# EAGLE design OLX_FOH_Lights (EAGLE 8.6.0)
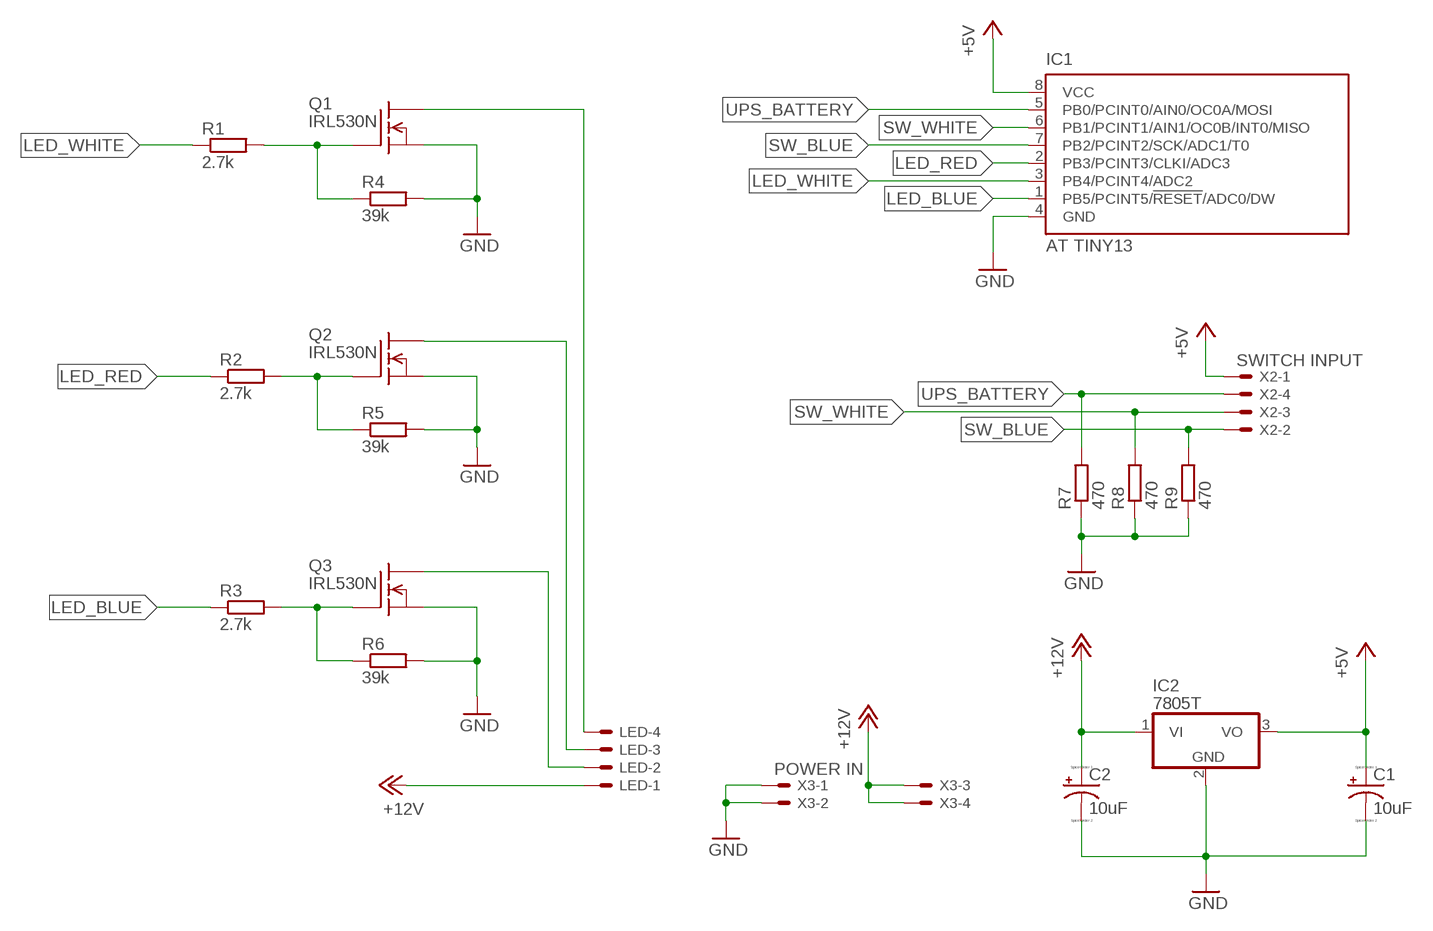
[diagram p0: schematic, sheet 1]

## Parts
C1  10uF  CPOL-USTT2D4  [TT2D4]
C2  10uF  CPOL-USTT2D4  [TT2D4]
IC1  AT TINY13  TINY13-20PU  [DIL08]
IC2  7805T  [TO220H]
LED  LED OUTPUT  22-23-2041  [22-23-2041]
Q1  IRL530N  BUZ10  [TO220]
Q2  IRL530N  BUZ10  [TO220]
Q3  IRL530N  BUZ10  [TO220]
R1  2.7k  R-EU_0411/12  [0411/12]
R2  2.7k  R-EU_0411/12  [0411/12]
R3  2.7k  R-EU_0411/12  [0411/12]
R4  39k  R-EU_0411/12  [0411/12]
R5  39k  R-EU_0411/12  [0411/12]
R6  39k  R-EU_0411/12  [0411/12]
R7  470  R-EU_0411/12  [0411/12]
R8  470  R-EU_0411/12  [0411/12]
R9  470  R-EU_0411/12  [0411/12]
X2  SWITCH INPUT  22-23-2041  [22-23-2041]
X3  POWER IN  22-23-2041  [22-23-2041]

## Nets
+5V: C1.+ IC1.8(VCC) IC2.3(VO) X2.1
+12V: C2.+ IC2.1(VI) LED.1 X3.3 X3.4
GND: C1.- C2.- IC1.4(GND) IC2.2(GND) Q1.3(S) Q2.3(S) Q3.3(S) R4.2 R5.2 R6.2 R7.1 R8.1 R9.1 X3.1 X3.2
LED_BLUE: IC1.1(PB5/PCINT5/!RESET!/ADC0/DW) R3.1
LED_RED: IC1.2(PB3/PCINT3/CLKI/ADC3) R2.1
LED_WHITE: IC1.3(PB4/PCINT4/ADC2) R1.1
N$1: Q1.1(G) R1.2 R4.1
N$2: LED.4 Q1.2(D)
N$3: LED.3 Q2.2(D)
N$4: Q3.1(G) R3.2 R6.1
N$5: LED.2 Q3.2(D)
N$7: Q2.1(G) R2.2 R5.1
SW_BLUE: IC1.7(PB2/PCINT2/SCK/ADC1/T0) R9.2 X2.2
SW_WHITE: IC1.6(PB1/PCINT1/AIN1/OC0B/INT0/MISO) R8.2 X2.3
UPS_BATTERY: IC1.5(PB0/PCINT0/AIN0/OC0A/MOSI) R7.2 X2.4

## Library data of the parts
C1 C2 = resistor:CPOL-US: POLARIZED CAPACITOR, American symbol
IC1 = atmel:TINY13: 8-bit AVR Microcontroller with 1K Bytes In-System Programmable Flash Source: http://www.atmel.com/dyn/resources/prod_documents/2535S.pdf; MPN: ATTINY13-20PU; OC_FARNELL: 9171550; OC_NEWARK: 96K6521
IC2 = linear:78*: Positive VOLTAGE REGULATOR Source: http://cache.national.com/ds/LM/LM78L05.pdf http://www.fairchildsemi.com/ds/LM/LM7805.pdf
LED X2 X3 = con-molex:22-23-2041: .100" (2.54mm) Center Header - 4 Pin; MF: MOLEX; MPN: 22-23-2041; OC_FARNELL: 1462920; OC_NEWARK: 38C0355
Q1-Q3 = transistor-fet:BUZ10: N-Channel Enhancement MOSFET 50V; 20A; 0,080Ohm
R1-R9 = resistor:R-EU_: RESISTOR, European symbol

## Board
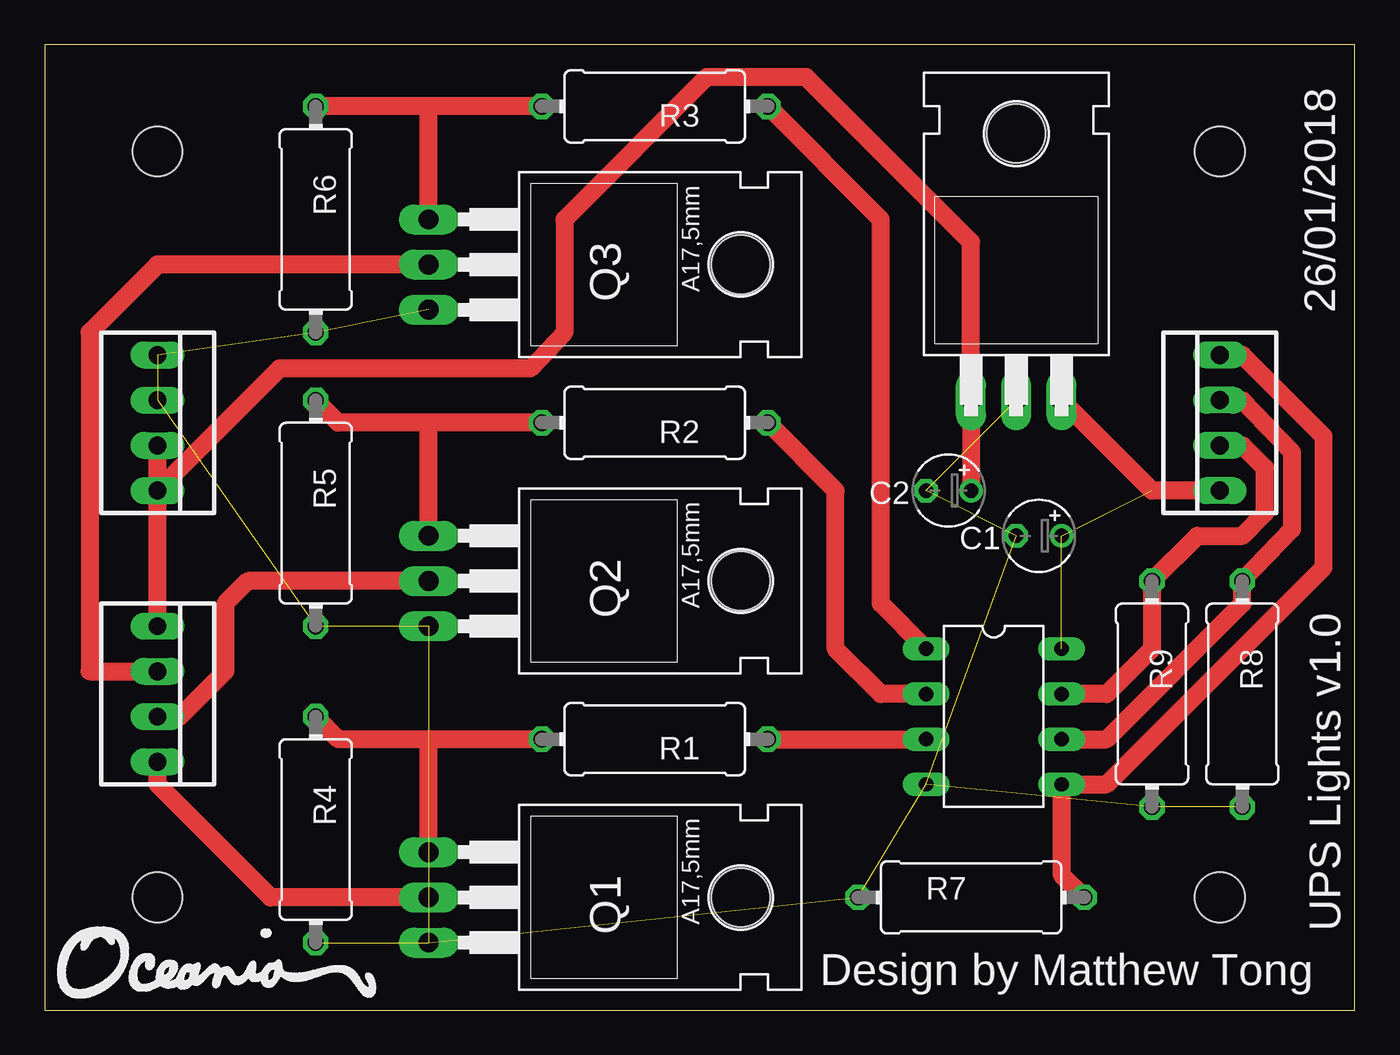
[diagram p1: board, top side]
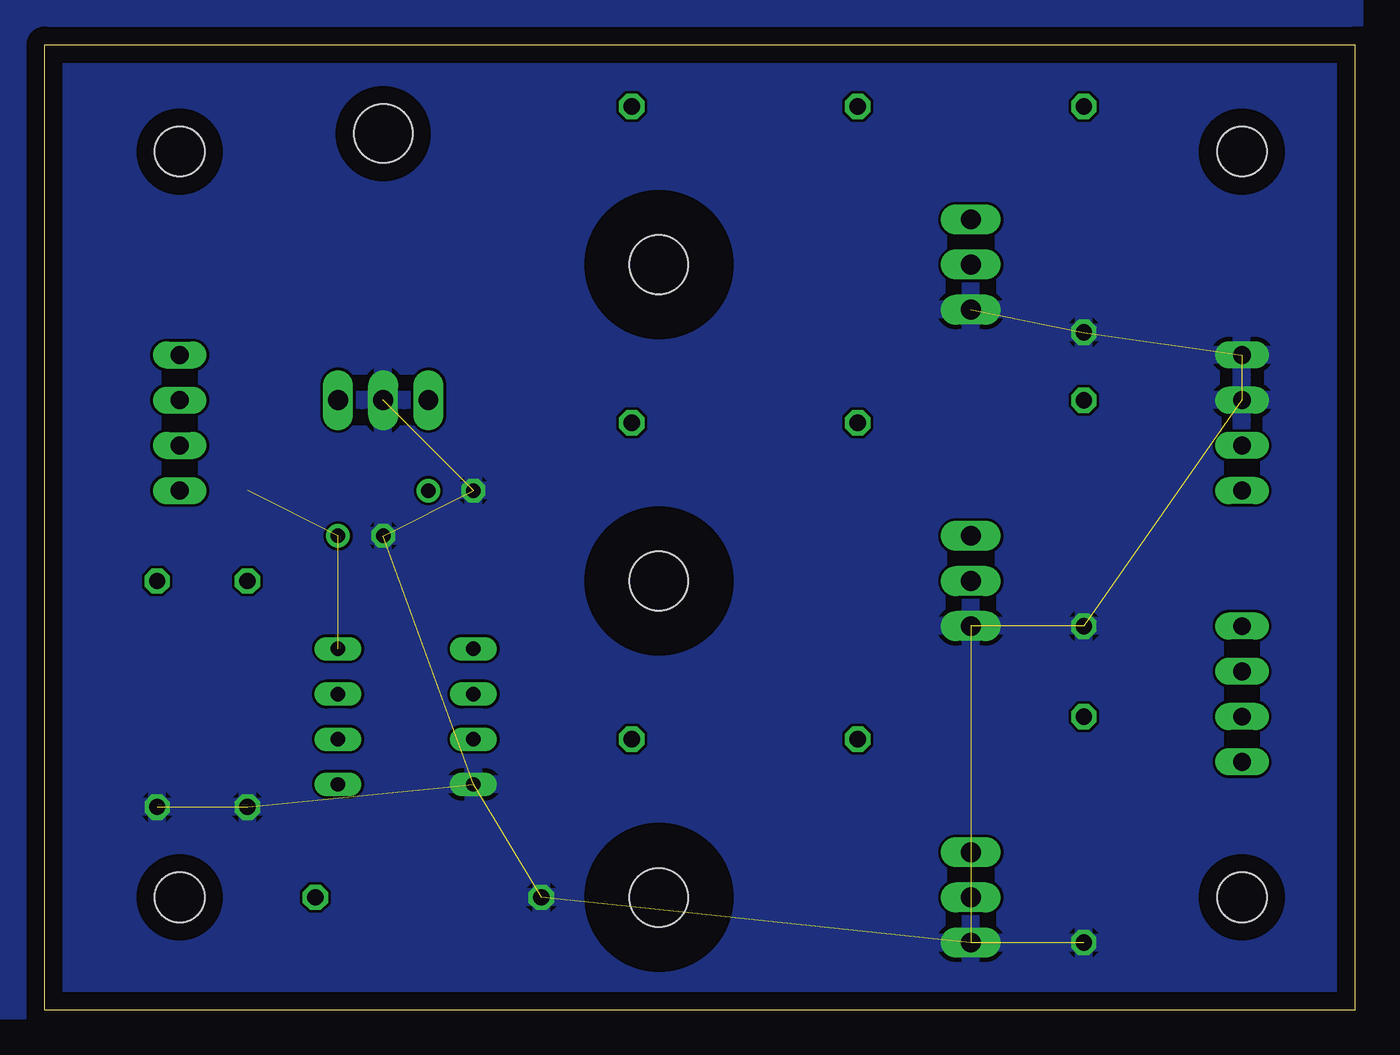
[diagram p2: board, bottom side, seen from below]

Size 73.64 x 54.28 mm. Coordinates in mm from the lower left corner, seen from the top.
Outline: 0,0 73.64,0 73.64,54.28 0,54.28 0,0
Copper layers (1*16): Top 0.035mm / dielectric 1.5mm / Bottom 0.035mm
Design rules "default": minimum track width 6mil, minimum drill 0.35mm, track to track 6mil, track to pad 6mil, pad to pad 6mil, via to via 6mil, smd to smd 6mil, copper to edge 40mil, drill to drill 6mil, minimum pad ring 10mil, minimum via ring 8mil, stop-mask expansion 4mil, vias tented up to drill 0mil, thermal gap 10mil
Holes 2.8 mm at 6.35,6.35 66.04,6.35 66.04,48.26 6.35,48.26

### Footprints (pad centres in the part's own frame; a part is rotated, then mirrored left to right if it is on the bottom)
TT2D4 = drill 0.813: + -1.27,0 | drill 0.813 octagon: - 1.27,0
DIL08 = drill 0.813 long: 1 -3.81,-3.81; 2 -1.27,-3.81; 3 1.27,-3.81; 4 3.81,-3.81; 5 3.81,3.81; 6 1.27,3.81; 7 -1.27,3.81; 8 -3.81,3.81
TO220H = drill 1.118 long: 1 -2.54,-10.16; 2 0,-10.16; 3 2.54,-10.16 | hole 3.302: 0,4.826
22-23-2041 = drill 1 long: 1 -3.81,0; 2 -1.27,0; 3 1.27,0; 4 3.81,0
TO220 = drill 1.118 long: 1 -2.54,-6.35; 2 0,-6.35; 3 2.54,-6.35 | hole 3.302: 0,11.176
0411/12 = drill 0.914 octagon: 1 -6.35,0; 2 6.35,0

### Placement (x,y rotation side)
C1  55.88,26.67 180 top
C2  50.8,29.21 180 top
IC1  53.34,16.51 270 top
IC2  54.61,44.45 0 top
LED  6.35,17.78 270 top
Q1  27.94,6.35 270 top
Q2  27.94,24.13 270 top
Q3  27.94,41.91 270 top
R1  34.29,15.24 180 top
R2  34.29,33.02 180 top
R3  34.29,50.8 180 top
R4  15.24,10.16 270 top
R5  15.24,27.94 270 top
R6  15.24,44.45 270 top
R7  52.07,6.35 0 top
R8  67.31,17.78 90 top
R9  62.23,17.78 90 top
X2  66.04,33.02 90 top
X3  6.35,33.02 270 top

### Tracks (layer width: path | path; a pad name or v marks a point on that pad's centre or on a via)
+5V  (2 unrouted)
  Top 1.016: X2.1 62.23,29.21 IC2.3
+12V
  Top 1.016: LED.1 X3.4 | X3.4 X3.3 | C2.+ IC2.1 52.07,43.18 42.8,52.45 37.21,52.45 29.21,44.45 29.21,38.1 27.3,36.07 13.21,36.07 X3.4
GND  (14 unrouted)
  pour Bottom: 0,64.77 82.55,64.77 82.55,0 0,0
LED_BLUE
  Top 1.016: IC1.1 46.99,22.86 46.99,44.45 R3.1
LED_RED
  Top 1.016: IC1.2 46.99,17.78 44.45,20.32 44.45,29.21 R2.1
LED_WHITE
  Top 1.016: R1.1 IC1.3
N$1
  Top 1.016: R1.2 21.59,15.24 | 21.59,15.24 16.51,15.24 R4.1 | Q1.1 21.59,15.24
N$2
  Top 1.016: Q1.2 12.7,6.35 6.35,12.7 LED.4
N$3
  Top 1.016: Q2.2 11.43,24.13 10.16,22.86 10.16,19.05 7.62,16.51 LED.3
N$4
  Top 1.016: R3.2 21.59,50.8 | 21.59,50.8 R6.1 | Q3.1 21.59,50.8
N$5
  Top 1.016: Q3.2 6.35,41.91 2.54,38.1 2.54,19.05 LED.2
N$7
  Top 1.016: R2.2 21.59,33.02 | 21.59,33.02 16.51,33.02 R5.1 | Q2.1 21.59,33.02
SW_BLUE
  Top 1.016: IC1.7 59.69,17.78 62.23,20.32 R9.2 64.77,26.67 67.31,26.67 68.58,27.94 68.58,30.48 67.31,31.75 X2.2
SW_WHITE
  Top 1.016: IC1.6 59.69,15.24 67.31,22.86 R8.2 70.1,27.05 70.1,31.37 67.31,34.29 X2.3
UPS_BATTERY
  Top 1.016: X2.4 67.31,36.83 71.88,32.26 71.88,24.89 59.69,12.7 IC1.5 57.15,7.62 R7.2

### Text on the board
tPlace: 26/01/2018
tNames: UPS Lights v1.0 | Design by Matthew Tong